# Altium schematic sheet POWER.SchDoc
size A4
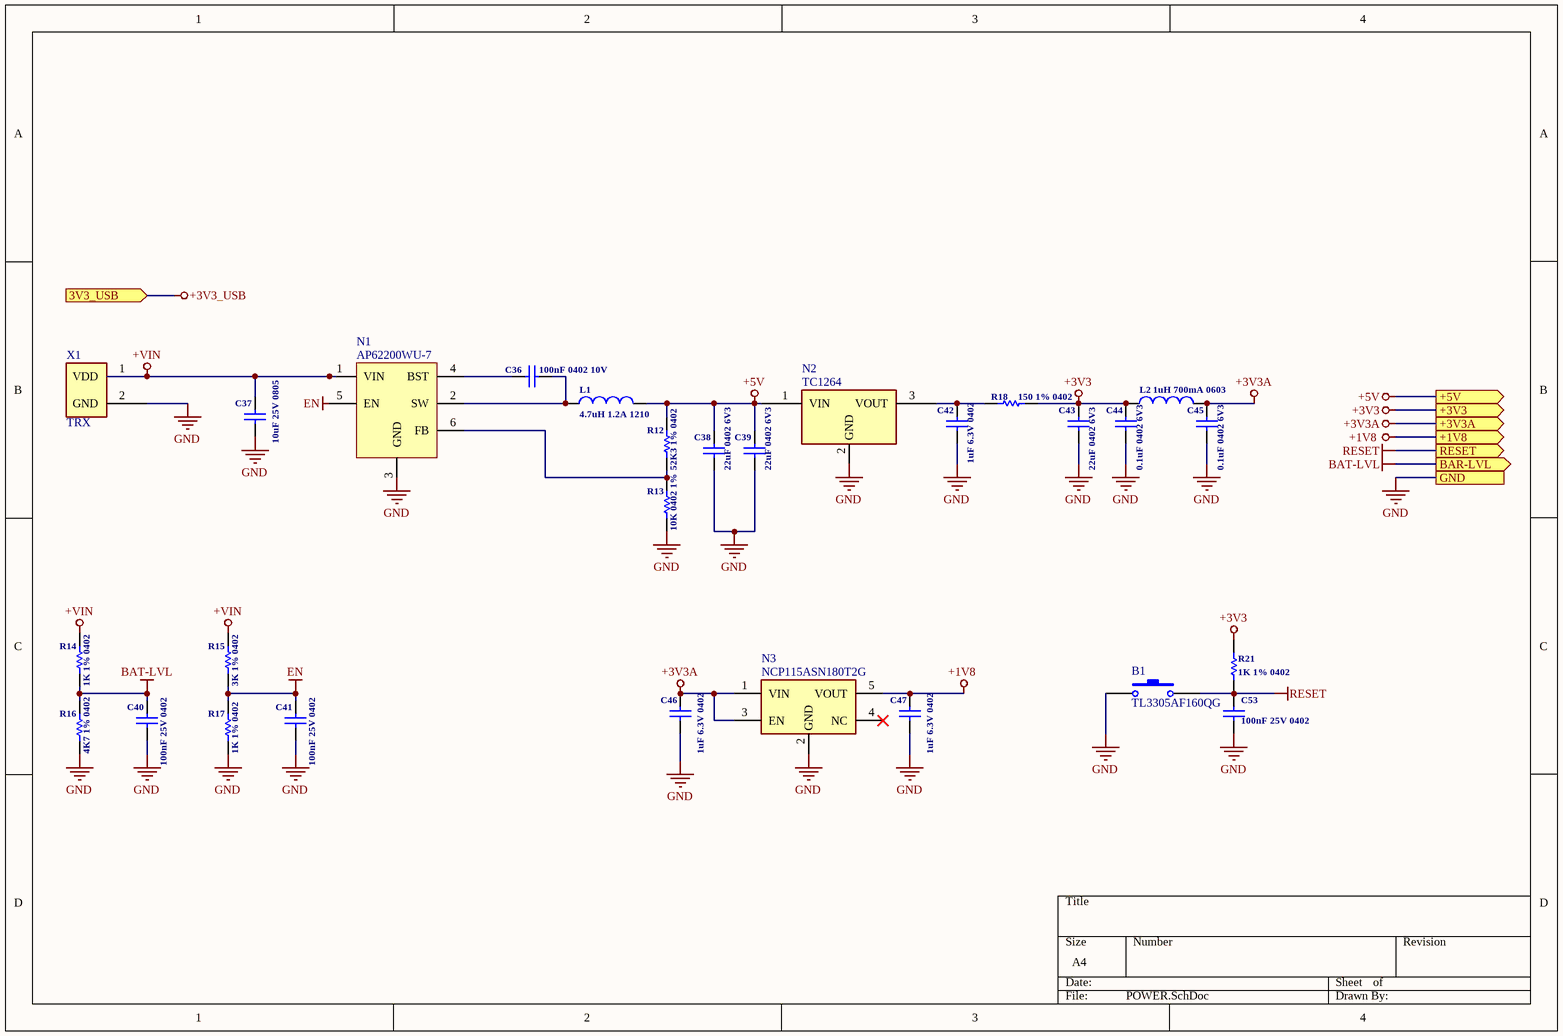
[diagram p0: POWER.SchDoc]

## Parts
B1  TL3305AF160QG
C36  100nF 0402 10V
C37  10uF 25V 0805
C38  22uF 0402 6V3
C39  22uF 0402 6V3
C40  100nF 25V 0402
C41  100nF 25V 0402
C42  1uF 6.3V 0402
C43  22uF 0402 6V3
C44  0.1uF 0402 6V3
C45  0.1uF 0402 6V3
C46  1uF 6.3V 0402
C47  1uF 6.3V 0402
C53  100nF 25V 0402
L1  4.7uH 1.2A 1210
L2  1uH 700mA 0603
N1  AP62200WU-7
N2  TC1264
N3  NCP115ASN180T2G  [NCP115ASN180T2G]
R12  52K3 1% 0402
R13  10K 0402 1%  [Resistor_0402]
R14  1K 1% 0402  [Resistor_0402]
R15  3K 1% 0402
R16  4K7 1% 0402  [Resistor_0402]
R17  1K 1% 0402  [Resistor_0402]
R18  150 1% 0402
R21  1K 1% 0402  [Resistor_0402]
X1  TRX

## Ports
3V3_USB (in), +1V8 (out), +3V3 (out), +3V3A (out), +5V (out), BAR-LVL (out), GND, RESET (out)

## Nets
+1V8 : C47.2 N3.5(VOUT) ; port +1V8
+3V3: C43.2 C44.2 L2.1 R18.2 R21.2 ; port +3V3
+3V3_USB: port 3V3_USB
+3V3A: C45.2 C46.2 L2.2 N3.1(VIN) N3.3(EN) ; port +3V3A
+5V: C38.2 C39.2 L1.2 N2.1(VIN) R12.2 ; port +5V
+VIN: C37.2 N1.1(VIN) R14.1 R15.2 X1.1(VDD)
BAT-LVL: C40.2 R14.2 R16.2 ; port BAR-LVL
EN: C41.2 R15.1 R17.1
GND: B1.1 C37.1 C38.1 C39.1 C40.1 C41.1 C42.1 C43.1 C44.1 C45.1 C46.1 C47.1 C53.1 N1.3(GND) N2.2(GND) N3.2(GND) R13.1 R16.1 R17.2 X1.2(GND) ; port GND
RESET: B1.3 C53.2 R21.1 ; port RESET
NetC36_1: C36.1 L1.1 N1.2(SW)
NetC36_2: C36.2 N1.4(BST)
NetC42_2: C42.2 N2.3(VOUT) R18.1
NetN1_6: N1.6(FB) R12.1 R13.2

Not connected (* = marked no-connect by the designer): N1 5(EN); N3 4(NC)*

## Notes on the sheet
- Labels drawn without touching a wire or pin: EN

## Library data of the parts
B1 = TL3305AF160QG: Tactile Switch SPST-NO Top Actuated Surface Mount; Supplier 1: Digi-Key; Supplier Part Number 1: EG5350CT-ND
C36 = CL05A104KP5NNNC 100nF 0402 10V: Cap Ceramic 0.1uF 10V X5R 10% SMD 0402 85C Paper T/R; Manufacturer: Samsung; Capacitance: 100000 pF; Supplier 1: Digi-Key; Manufacturer Part Number: CL05A104KP5NNNC; Stock 1: 5595689; Pricing 1: 1=0.1, 10=0.021, 50=0.0116, 100=0.0094, 500=0.0067, 1000=0.0053, 2500=0.0048, 5000=0.0044 (USD); Case Size/Dimension: 0402; Dielectric: X5R; Tolerance (%): ±10 %; Rated Voltage: 10 V; ComponentLink1URL: https://www.distrelec.biz/Web/Downloads/_e/ng/MLCC_CatalogDownload2013_ENG.pdf?mime=application%2Fpdf&src-supplier=Distrelec; ComponentLink1Description: https://www.distrelec.biz/Web/Downloads/_e/ng/MLCC_CatalogDownload2013_ENG.pdf?mime=application%2Fpdf&src-supplier=Distrelec; ComponentLink2URL: https://media.digikey.com/pdf/Data%20Sheets/Samsung%20PDFs/CL_Series_MLCC_ds.pdf?src-supplier=Digi-Key; ComponentLink2Description: https://media.digikey.com/pdf/Data%20Sheets/Samsung%20PDFs/CL_Series_MLCC_ds.pdf?src-supplier=Digi-Key; ComponentLink3URL: http://www1.futureelectronics.com/doc/SAMSUNG%20PASSIVE/CL05B104KQ5NNNC.pdf?src-supplier=Future+Electronics; ComponentLink3Description: http://www1.futureelectronics.com/doc/SAMSUNG%20PASSIVE/CL05B104KQ5NNNC.pdf?src-supplier=Future+Electronics; ComponentLink4URL: https://www.verical.com/server-webapp/html/getDatasheet?partID=358611&src-supplier=Verical; ComponentLink4Description: https://www.verical.com/server-webapp/html/getDatasheet?partID=358611&src-supplier=Verical; Supplier Part Number 1: 1276-1022-1-ND; Value: 100nF 0402 10V
C37 = CL21A106KAYNNNG 10uF 0805: 10 µF ±10% 25V Ceramic Capacitor X5R 0805 (2012 Metric); Supplier 1: Digi-Key; Supplier Part Number 1: 1276-6454-1-ND; Value: 10uF 25V 0805
C38 C39 C43 = CL05A226MQ5N6J8 22uF 0402 6V3: CL05 Series 22 uF 6.3 V ±20% Tolerance X5R SMT Multilayer Ceramic Capacitor; Manufacturer: Samsung; Categories: Capacitors; Capacitance: 22µF; Voltage - Rated: 6.3V; Supplier 1: Digi-Key; Manufacturer Part Number: CL05A226MQ5N6J8; Stock 1: 135434; Pricing 1: 1=0.53, 10=0.366, 50=0.2564, 100=0.2197, 500=0.1648, 1000=0.1392, 2500=0.1318 (USD); Series: CL; Packaging: Tape & Reel (TR); Part Status: Active; Tolerance: ±20%; Temperature Coefficient: X5R; Operating Temperature: -55°C ~ 85°C; Features: -; Ratings: -; Applications: General Purpose; Failure Rate: -; Mounting Type: Surface Mount, MLCC; Package / Case: 0402 (1005 Metric); Size / Dimension: 0.039 L x 0.020 W (1.00mm x 0.50mm); Height - Seated (Max): -; Thickness (Max): 0.030 (0.75mm); Lead Spacing: -; Lead Style: -; ComponentLink1URL: http://www.samsungsem.com/kr/support/library/product-catalog/mlcc.jsp?src-supplier=Digi-Key; ComponentLink1Description: http://www.samsungsem.com/kr/support/library/product-catalog/mlcc.jsp?src-supplier=Digi-Key; Supplier Part Number 1: 1276-7090-1-ND; Value: 22uF 0402 6V3
C40 C41 C53 = CL05A104KA5NNNC 100nf 0402: 100nF, 25V, MLCC, 0402; Manufacturer: Samsung; Capacitance: 0.1 µF; Dielectric: X5R; Tolerance (%): ±10 %; Supplier 1: Digi-Key; Manufacturer Part Number: CL05A104KA5NNNC; Stock 1: 8000233; Pricing 1: 1=0.1, 10=0.012, 50=0.0064, 100=0.0053, 500=0.0038, 1000=0.003, 2500=0.0027, 5000=0.0025 (USD); Case Size/Dimension: 0402; Rated Voltage: 25 V; ComponentLink1URL: http://www1.futureelectronics.com/doc/SAMSUNG/CL05A104KA5NNNC.pdf?src-supplier=Future+Electronics; ComponentLink1Description: http://www1.futureelectronics.com/doc/SAMSUNG/CL05A104KA5NNNC.pdf?src-supplier=Future+Electronics; ComponentLink2URL: http://www.samsungsem.com/kr/support/product-search/mlcc/CL05A104KA5NNNC.jsp?src-supplier=Digi-Key; ComponentLink2Description: http://www.samsungsem.com/kr/support/product-search/mlcc/CL05A104KA5NNNC.jsp?src-supplier=Digi-Key; ComponentLink3URL: https://www.distrelec.biz/Web/Downloads/_e/ng/MLCC_CatalogDownload2013_ENG.pdf?mime=application%2Fpdf&src-supplier=Distrelec; ComponentLink3Description: https://www.distrelec.biz/Web/Downloads/_e/ng/MLCC_CatalogDownload2013_ENG.pdf?mime=application%2Fpdf&src-supplier=Distrelec; ComponentLink4URL: https://www.verical.com/server-webapp/html/getDatasheet?partID=357412&src-supplier=Verical; ComponentLink4Description: https://www.verical.com/server-webapp/html/getDatasheet?partID=357412&src-supplier=Verical; Supplier Part Number 1: 1276-1043-1-ND; Value: 100nF 25V 0402
C42 C46 C47 = CL05A105KQ5NNNC 1uF 0402: SAMSUNG ELECTRO-MECHANICS - CL05A105KQ5NNNC - SMD Multilayer Ceramic Capacitor, 1 µF, 6.3 V, 0402 [1005 Metric], ± 10%, X5R, CL Series; Capacitance: 1000000 pF; Supplier 1: Digi-Key; Manufacturer: Samsung; Manufacturer Part Number: CL05A105KQ5NNNC; Stock 1: 2633061; Pricing 1: 1=0.1, 10=0.019, 50=0.0106, 100=0.0087, 500=0.0062, 1000=0.0049, 2500=0.0044, 5000=0.0041 (USD); Case Size/Dimension: 0402; Dielectric: X5R; Tolerance (%): ±10 %; Rated Voltage: 6.3 V; ComponentLink1URL: http://www.samsungsem.com/kr/support/product-search/mlcc/CL05A105KQ5NNNC.jsp?src-supplier=Digi-Key; ComponentLink1Description: http://www.samsungsem.com/kr/support/product-search/mlcc/CL05A105KQ5NNNC.jsp?src-supplier=Digi-Key; ComponentLink2URL: http://www1.futureelectronics.com/doc/SAMSUNG%20PASSIVE/CL05B104KQ5NNNC.pdf?src-supplier=Future+Electronics; ComponentLink2Description: http://www1.futureelectronics.com/doc/SAMSUNG%20PASSIVE/CL05B104KQ5NNNC.pdf?src-supplier=Future+Electronics; ComponentLink3URL: https://www.verical.com/server-webapp/html/getDatasheet?partID=358391&src-supplier=Verical; ComponentLink3Description: https://www.verical.com/server-webapp/html/getDatasheet?partID=358391&src-supplier=Verical; ComponentLink4URL: https://produktinfo.conrad.com/datenblaetter/450000-474999/459172-da-01-en-VS_KONDENSATOR_0402.pdf?src-supplier=Conrad; ComponentLink4Description: https://produktinfo.conrad.com/datenblaetter/450000-474999/459172-da-01-en-VS_KONDENSATOR_0402.pdf?src-supplier=Conrad; Supplier Part Number 1: 1276-1010-1-ND; Value: 1uF 6.3V 0402
C44 C45 = CL05B104KQ5NNNC 0.1uF 0402 6V3: 0.1 µF ±10% 6.3V Ceramic Capacitor X7R 0402 (1005 Metric); Supplier 1: Digi-Key; Supplier Part Number 1: 1276-1511-1-ND; Value: 0.1uF 0402 6V3
L1 = 1276AS-H-4R7M=P2: 4.7 µH Shielded Wirewound Inductor 1.2 A 264mOhm Max 1210 (3225 Metric); Supplier 1: Digi-Key; Supplier Part Number 1: 490-10585-1-ND; Value: 4.7uH 1.2A 1210
L2 = MLZ1608N1R0LT000: 1 µH Shielded Multilayer Inductor 700 mA 110mOhm 0603 (1608 Metric); Supplier 1: Digi-Key; Supplier Part Number 1: 445-6753-1-ND; Value: 1uH 700mA 0603
N1 = AP62200WU-7: Buck Switching Regulator IC Positive Adjustable 0.8V 1 Output 2A SOT-23-6 Thin, TSOT-23-6; Supplier 1: Digi-Key; Supplier Part Number 1: 31-AP62200WU-7CT-ND
N2 = TC1264-3.3VDBTR: Linear Voltage Regulator IC Positive Fixed 1 Output 800mA SOT-223-3; Supplier 1: Digi-Key; Supplier Part Number 1: TC1264-3.3VDBCT-ND
R12 = RT0402FRE0752K3L 52K3 1% 0402: RES SMD 52.3K OHM 1% 1/16W 0402; Supplier 1: Digi-Key; Supplier Part Number 1: 13-RT0402FRE0752K3LCT-ND; Value: 52K3 1% 0402
R13 = AC0402FR-0710KL 10K 0402 1%: RES SMD 10K OHM 1% 1/16W 0402; Manufacturer: Yageo; Resistance: 10 kOhms; Power Rating: 62.5 mW (1/16 W); Voltage Rating: 50 V; Temperature Coefficient: 100 PPM / C; Supplier 1: Digi-Key; Manufacturer Part Number: AC0402FR-0710KL; Stock 1: 1375478; Pricing 1: 1=0.1, 10=0.021, 100=0.0086, 1000=0.0039, 2500=0.0033, 5000=0.0028 (USD); Termination Style: SMD/SMT; Product: Thick Film Resistors SMD; Tolerance: 1 %; Case Code - in: 0402; Case Code - mm: 1005; Series: AC; Operating Temperature Range: - 55 C to + 155 C; Packaging: Reel; ComponentLink1URL: http://www.mouser.com/ds/2/447/yageodocoutput-1111992.pdf?src-supplier=Mouser; ComponentLink1Description: http://www.mouser.com/ds/2/447/yageodocoutput-1111992.pdf?src-supplier=Mouser; Supplier Part Number 1: YAG3436CT-ND; Value: 10K 0402 1%
R14 R17 R21 = PFR05S-102-FNH 1K 1% 0402: Res SMD 1 Kohm 1% 1/16W 0402; Manufacturer: Cyntec; Supplier 1: Digi-Key; Manufacturer Part Number: PFR05S-102-FNH; Stock 1: 811154; Pricing 1: 1=0.1, 10=0.014, 100=0.0056, 1000=0.0025, 2500=0.0022, 5000=0.0018 (USD); Supplier Part Number 1: 2037-PFR05S-102-FNHCT-ND; Value: 1K 1% 0402
R15 = RMCF0402FT3K00 3K 0402 1%: 3 kOhms ±1% 0.063W, 1/16W Chip Resistor 0402 (1005 Metric) Automotive AEC-Q200 Thick Film; Supplier 1: Digi-Key; Supplier Part Number 1: RMCF0402FT3K00CT-ND; Value: 3K 1% 0402
R16 = AC0402FR-074K7L 4.7K 1% 0402: Thick Film Resistors 1/16W 4.7K ohm 1% AEC-Q200; Manufacturer: Yageo; Resistance: 4.7 kOhms; Power Rating: 62.5 mW (1/16 W); Temperature Coefficient: 100 PPM / C; Voltage Rating: 50 V; Unit Weight: 0.000023 oz; Supplier 1: Digi-Key; Manufacturer Part Number: AC0402FR-074K7L; Stock 1: 3; Pricing 1: 1=0.1, 10=0.021, 100=0.0086, 1000=0.0039, 2500=0.0033, 5000=0.0028 (USD); Product Category: Thick Film Resistors; RoHS: True; Tolerance: 1 %; Case Code - in: 0402; Case Code - mm: 1005; Operating Temperature Range: - 55 C to + 155 C; Series: AC; Brand: Yageo; Height: 0.32 mm; Length: 1 mm; Package / Case: 0402 (1005 metric); Packaging: Reel; Product: Thick Film Resistors SMD; Termination Style: SMD/SMT; Type: Chip Resistor Surface Mount; Width: 0.5 mm; ComponentLink1URL: http://www.mouser.com/ds/2/447/yageodocoutput-1111992.pdf?src-supplier=Mouser; ComponentLink1Description: http://www.mouser.com/ds/2/447/yageodocoutput-1111992.pdf?src-supplier=Mouser; ComponentLink2URL: http://www.yageo.com/documents/recent/PYu-AC_51_RoHS_L_2_revised.pdf?src-supplier=Future+Electronics; ComponentLink2Description: http://www.yageo.com/documents/recent/PYu-AC_51_RoHS_L_2_revised.pdf?src-supplier=Future+Electronics; ComponentLink3URL: http://www.yageo.com/NewPortal/yageodocoutput?fileName=/pdf/R-Chip/PYu-AC_51_RoHS_L_6.pdf&src-supplier=Digi-Key; ComponentLink3Description: http://www.yageo.com/NewPortal/yageodocoutput?fileName=/pdf/R-Chip/PYu-AC_51_RoHS_L_6.pdf&src-supplier=Digi-Key; Supplier Part Number 1: YAG3497CT-ND; Value: 4K7 1% 0402
R18 = RMCF0402FT150R 150 1% 0402: 150 Ohms ±1% 0.063W, 1/16W Chip Resistor 0402 (1005 Metric) Automotive AEC-Q200 Thick Film; Supplier 1: Digi-Key; Supplier Part Number 1: RMCF0402FT150RCT-ND; Value: 150 1% 0402
N3 = NCP115ASN180T2G: Supplier 1: Digi-Key; Supplier Part Number 1: NCP115ASN180T2GOSCT-ND